# EAGLE design Lego PowerFunctions I2C RPi Connect (EAGLE 7.2.0)
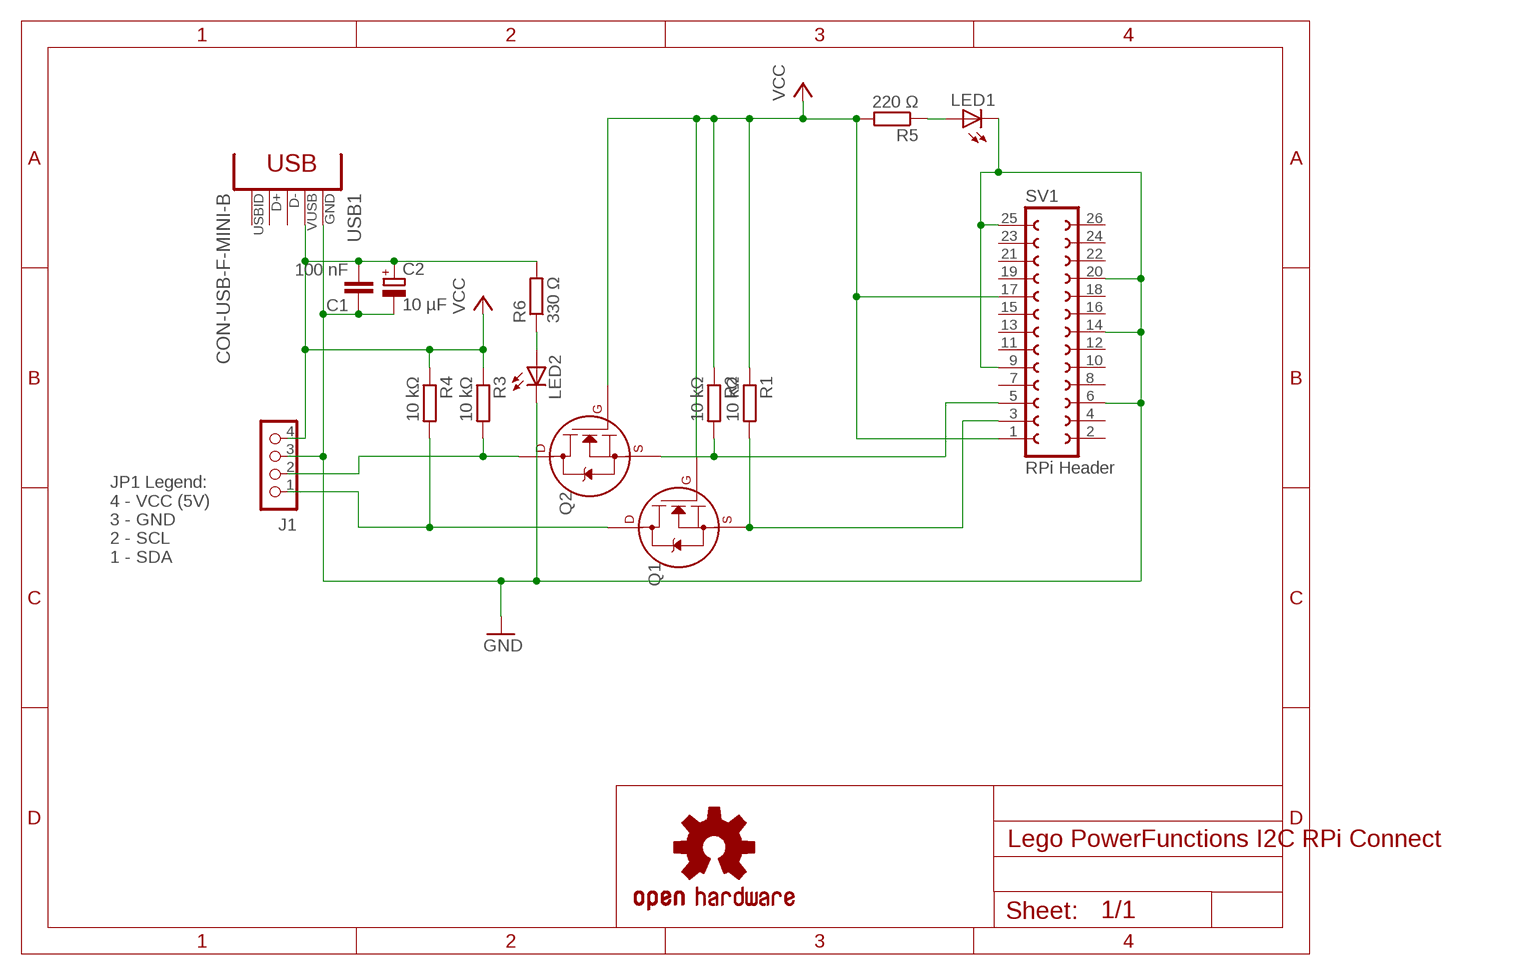
[diagram p0: schematic, sheet 1]

## Parts
C1  100 nF  C-EU025-025X050  [C025-025X050]
C2  10 µF  CPOL-EUE2.5-6  [E2,5-6]
J1  CON_HEADER_1X04  [M1X4]
LED1  LED3MM  [LED3MM]
LED2  LED3MM  [LED3MM]
LOGO1  OSHW-LOGOL  [OSHW-LOGO-L]
Q1  2N7000_TO92  [TO-92]
Q2  2N7000_TO92  [TO-92]
R1  10 kΩ  R-EU_0207/10  [0207/10]
R2  10 kΩ  R-EU_0207/10  [0207/10]
R3  10 kΩ  R-EU_0207/10  [0207/10]
R4  10 kΩ  R-EU_0207/10  [0207/10]
R5  220 Ω  R-EU_0207/10  [0207/10]
R6  330 Ω  R-EU_0207/10  [0207/10]
SV1  RPi Header  FE13-2  [FE13-2]
USB1  CON-USB-F-MINI-B  [CONN_USB_MINI-B]

## Nets
GND: C1.1 C2.- J1.3 LED1.K(C) LED2.K(C) SV1.6 SV1.9 SV1.14 SV1.20 SV1.25 USB1.GND
N$1: LED1.A R5.1
N$2: LED2.A R6.1
N$3: Q1.1(S) R1.2 SV1.3
SCL_HV: J1.2 Q2.3(D) R3.2
SCL_LV: Q2.1(S) R2.2 SV1.5
SDA_HV: J1.1 Q1.3(D) R4.2
VCC_HV: C1.2 C2.+ J1.4 R3.1 R4.1 R6.2 USB1.VUSB ; supply symbol labelled VCC
VCC_LV: Q1.2(G) Q2.2(G) R1.1 R2.1 R5.2 SV1.1 SV1.17 ; supply symbol labelled VCC
Unconnected: SV1.2 SV1.4 SV1.7 SV1.8 SV1.10 SV1.11 SV1.12 SV1.13 SV1.15 SV1.16 SV1.18 SV1.19 SV1.21 SV1.22 SV1.23 SV1.24 SV1.26 USB1.BODY@1(BODY) USB1.BODY@2(BODY) USB1.BODY@3(BODY) USB1.BODY@4(BODY) USB1.D+ USB1.D- USB1.ID(USBID)

## Notes on the sheet
- JP1 Legend:
  4 - VCC (5V)
  3 - GND
  2 - SCL
  1 - SDA

## Library data of the parts
C1 = rcl:C-EU: CAPACITOR, European symbol
C2 = rcl:CPOL-EU: POLARIZED CAPACITOR, European symbol
J1 = dp_devices:CON_HEADER_1X04
LED1 LED2 = led:LED: LED OSRAM: - CHIPLED LG R971, LG N971, LY N971, LG Q971, LY Q971, LO R971, LY R971 LH N974, LH R974 LS Q976, LO Q976, LY Q976 LO Q996 - Hyper CHIPLED LW Q18S LB Q993, LB Q99A, LB R99A - SideLED LS A670, LO A670, LY A670, LG A670, LP A670 LB A673, LV A673, LT A673, LW A673 LH A674 LY A675 LS A676, LA A676, LO A676, LY A676, LW A676 LS A679, LY A679, LG A679 - Hyper Micro SIDELED® LS Y876, LA Y876, LO Y876, LY Y876 LT Y87S - SmartLED LW L88C, LW L88S LB L89C, LB L89S, LG L890 LS L89K, LO L89K, LY L89K LS L896, LA L896, LO L896, LY L896 - TOPLED LS T670, LO T670, LY T670, LG T670, LP T670 LSG T670, LSP T670, LSY T670, LOP T670, LYG T670 LG T671, LOG T671, LSG T671 LB T673, LV T673, LT T673, LW T673 LH T674 LS T676, LA T676, LO T676, LY T676, LB T676, LH T676, LSB T676, LW T676 LB T67C, LV T67C, LT T67C, LS T67K, LO T67K, LY T67K, LW E67C LS E67B, LA E67B, LO E67B, LY E67B, LB E67C, LV E67C, LT E67C LW T67C LS T679, LY T679, LG T679 LS T770, LO T770, LY T770, LG T770, LP T770 LB T773, LV T773, LT T773, LW T773 LH T774 LS E675, LA E675, LY E675, LS T675 LS T776, LA T776, LO T776, LY T776, LB T776 LHGB T686 LT T68C, LB T68C - Hyper Mini TOPLED® LB M676 - Mini TOPLED Santana® LG M470 LS M47K, LO M47K, LY M47K Source: http://www.osram.convergy.de LUXEON: - LUMILED® LXK2-PW12-R00, LXK2-PW12-S00, LXK2-PW14-U00, LXK2-PW14-V00 LXK2-PM12-R00, LXK2-PM12-S00, LXK2-PM14-U00 LXK2-PE12-Q00, LXK2-PE12-R00, LXK2-PE12-S00, LXK2-PE14-T00, LXK2-PE14-U00 LXK2-PB12-K00, LXK2-PB12-L00, LXK2-PB12-M00, LXK2-PB14-N00, LXK2-PB14-P00, LXK2-PB14-Q00 LXK2-PR12-L00, LXK2-PR12-M00, LXK2-PR14-Q00, LXK2-PR14-R00 LXK2-PD12-Q00, LXK2-PD12-R00, LXK2-PD12-S00 LXK2-PH12-R00, LXK2-PH12-S00 LXK2-PL12-P00, LXK2-PL12-Q00, LXK2-PL12-R00 Source: www.luxeon.com KINGBRIGHT: KA-3528ASYC Source: www.kingbright.com
LOGO1 = SparkFun-Aesthetics:OSHW-LOGO: Open Source Hardware Logo This logo indicates the piece of hardware it is found on incorporates a OSHW license and/or adheres to the definition of open source hardware found here: http://freedomdefined.org/OSHW
Q1 Q2 = transistors:2N700*: 2N7000, 2N7002, NDS7002A N-channel enhancement mode MOSFET
R1-R6 = rcl:R-EU_: RESISTOR, European symbol
SV1 = con-lsta:FE13-2: FEMALE HEADER; OC_FARNELL: unknown; OC_NEWARK: unknown
USB1 = dp_devices:CON-USB-F: USB Female connector

## Board
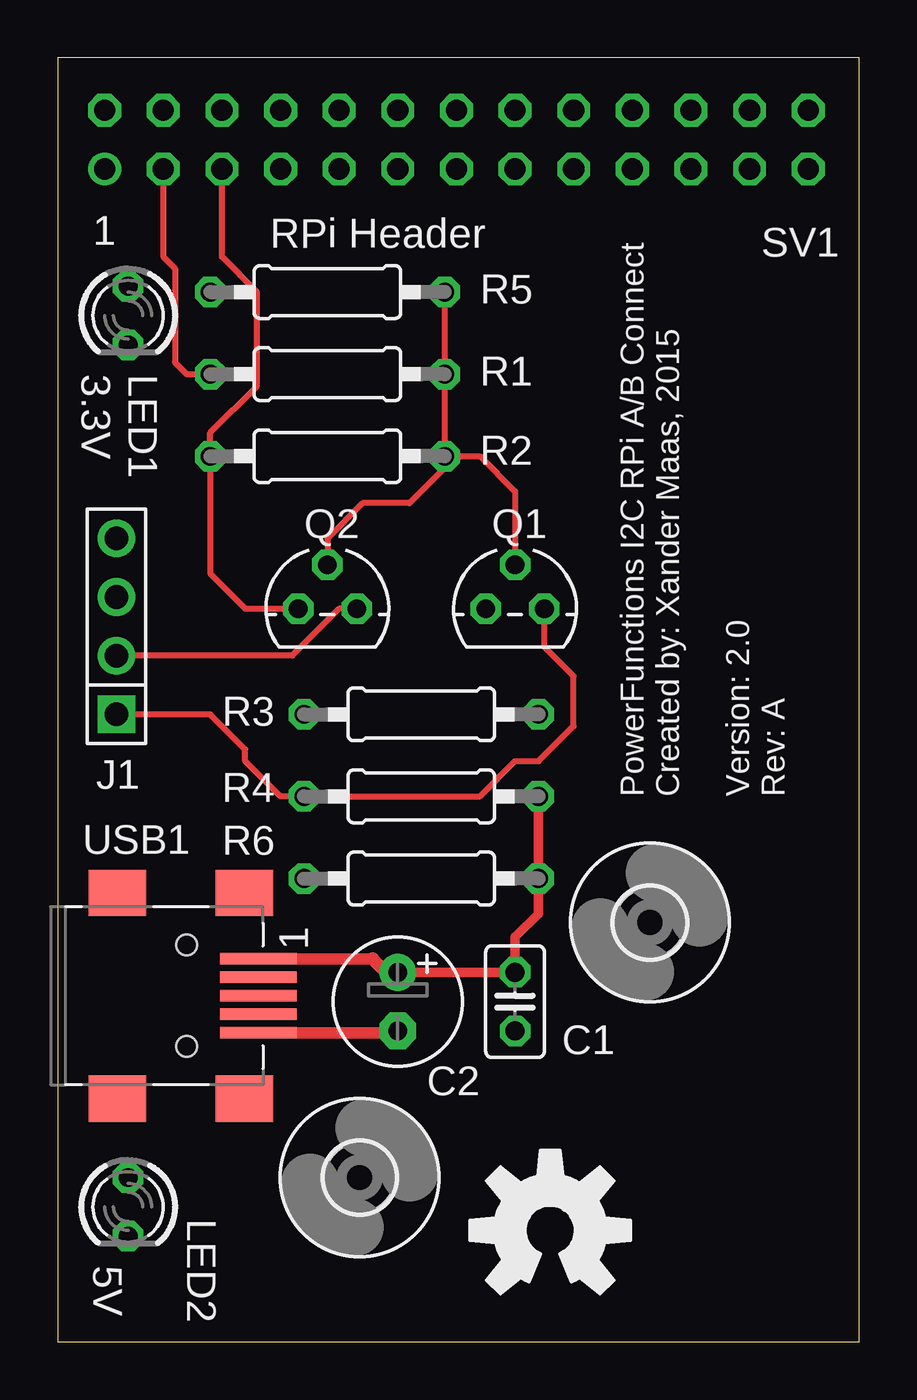
[diagram p1: board, top side]
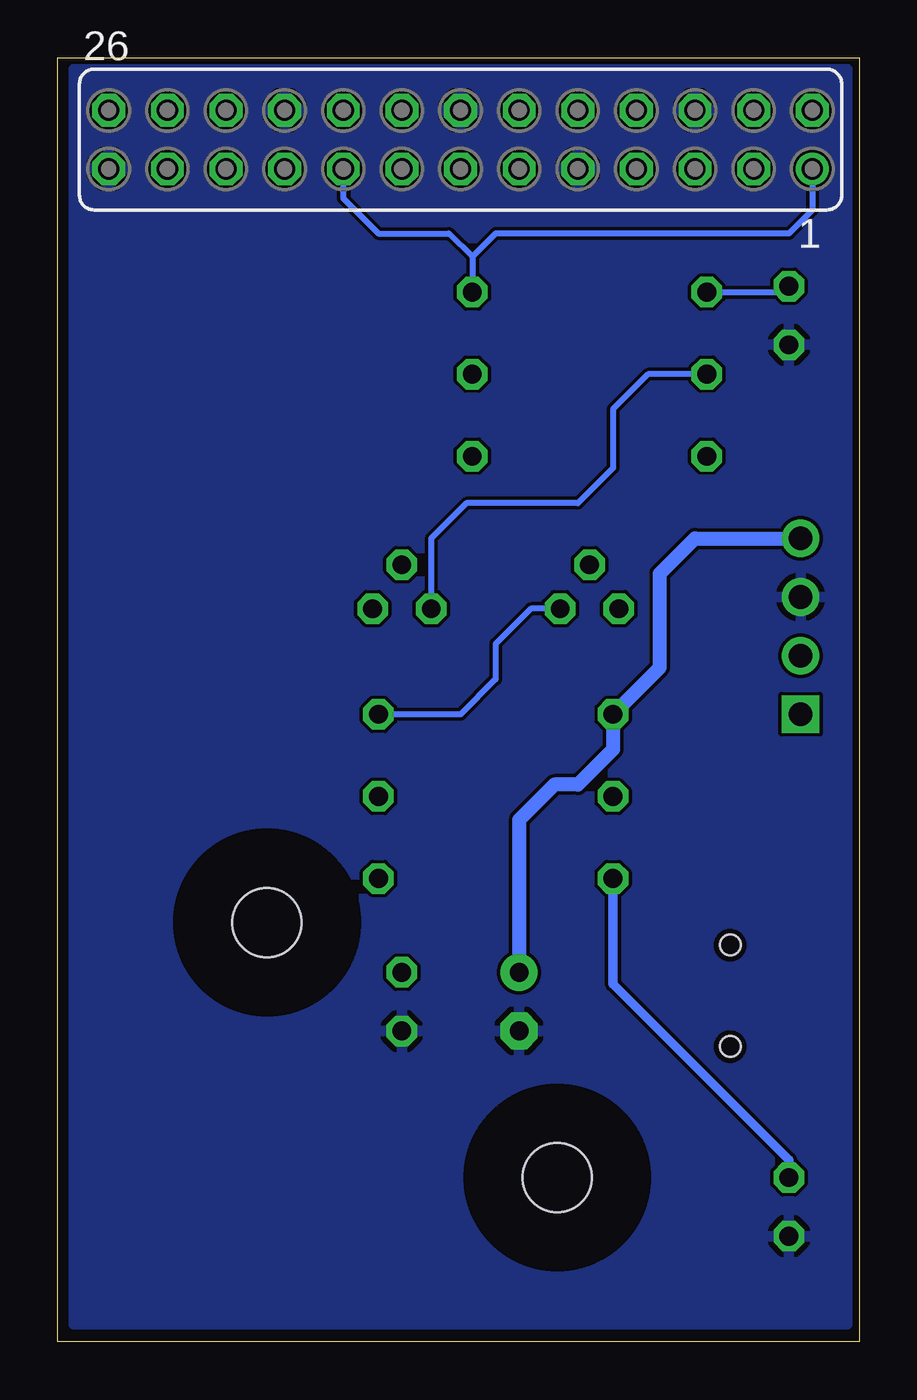
[diagram p2: board, bottom side, seen from below]

Size 34.72 x 55.62 mm. Coordinates in mm from the lower left corner, seen from the top.
Outline: 0,0 34.72,0 34.72,55.62 0,55.62 0,0
Copper layers (1*16): Top 0.035mm / dielectric 1.5mm / Bottom 0.035mm
Design rules "SeeedStudio_2layer_DRU_no_angle_20140221": minimum track width 6mil, minimum drill 12mil, track to track 6mil, track to pad 6mil, pad to pad 6mil, via to via 6mil, smd to smd 0mil, copper to edge 10mil, drill to drill 10mil, minimum pad ring 10mil, minimum via ring 6mil, stop-mask expansion 2mil, vias tented up to drill 100mil, thermal gap 10mil

### Footprints (pad centres in the part's own frame; a part is rotated, then mirrored left to right if it is on the bottom)
C025-025X050 = drill 0.813 octagon: 1 -1.27,0; 2 1.27,0
E2,5-6 = drill 0.813 pad 1.6: + -1.27,0 | drill 0.813 pad 1.6 octagon: - 1.27,0
M1X4 = drill 1.02 pad 1.632 square: 1 0,0 | drill 1.02 pad 1.632: 2 2.54,0; 3 5.08,0; 4 7.62,0
LED3MM = drill 0.813 octagon: A -1.27,0; K 1.27,0
TO-92 = drill 0.813 octagon: 1 -1.27,0; 2 0,1.905; 3 1.27,0
0207/10 = drill 0.813 octagon: 1 -5.08,0; 2 5.08,0
FE13-2 = drill 0.914: 1 -15.24,1.27 | drill 0.914 octagon: 2 -15.24,-1.27; 3 -12.7,1.27; 4 -12.7,-1.27; 5 -10.16,1.27; 6 -10.16,-1.27; 7 -7.62,1.27; 8 -7.62,-1.27; 9 -5.08,1.27; 10 -5.08,-1.27; 11 -2.54,1.27; 12 -2.54,-1.27; 13 0,1.27; 14 0,-1.27; 15 2.54,1.27; 16 2.54,-1.27; 17 5.08,1.27; 18 5.08,-1.27; 19 7.62,1.27; 20 7.62,-1.27; 21 10.16,1.27; 22 10.16,-1.27; 23 12.7,1.27; 24 12.7,-1.27; 25 15.24,1.27; 26 15.24,-1.27
3,0 = hole 3: 0,0
CONN_USB_MINI-B = smd 2 x 2.5: BODY@1 -4.45,2.5; BODY@2 4.45,2.5; BODY@3 4.45,-3; BODY@4 -4.45,-3 | smd 0.5 x 3.3: D+ 0,3.1; D- -0.8,3.1; GND 1.6,3.1; ID 0.8,3.1; VUSB -1.6,3.1 | hole 0.9: -2.2,0; 2.2,0

### Placement (x,y rotation side)
C1  19.81,14.73 90 top
C2  14.73,14.73 270 top
J1  2.54,27.18 90 top
LED1  3.05,44.45 270 top
LED2  3.05,5.84 270 top
LOGO1  21.34,4.83 0 top
Q1  19.81,31.75 0 top
Q2  11.68,31.75 0 top
R1  11.68,41.91 180 top
R2  11.68,38.35 180 top
R3  15.75,27.18 0 top
R4  15.75,23.62 180 top
R5  11.68,45.47 0 top
R6  15.75,20.07 0 top
SV1  17.27,52.07 180 bottom
U$1  [3,0]  13.08,7.11 0 top
U$3  [3,0]  25.65,18.16 0 top
USB1  5.59,14.99 270 top

### Tracks (layer width: path | path; a pad name or v marks a point on that pad's centre or on a via)
GND
  Top 0.406: 14.66,13.39 C2.-
  Top 0.508: USB1.GND 14.66,13.39
  pour Bottom: 0.51,55.12 0.51,0.76 34.04,0.76 34.04,55.12
N$1
  Bottom 0.254: R5.1 3.3,45.47 LED1.A
N$2
  Bottom 0.406: R6.1 10.67,15.49 3.05,7.87 LED2.A
N$3
  Top 0.254: SV1.3 4.57,46.99 5.08,46.48 5.08,42.42 5.59,41.91 R1.2
  Bottom 0.254: R1.2 9.14,41.91 10.67,40.39 10.67,37.85 12.19,36.32 17.02,36.32 18.54,34.8 Q1.1
SCL_HV
  Top 0.254: Q2.3 12.19,31.75 10.16,29.72 J1.2
  Bottom 0.254: Q2.3 14.22,31.75 15.75,30.23 15.75,28.7 17.27,27.18 R3.2
SCL_LV
  Top 0.254: SV1.5 7.11,46.99 8.64,45.47 8.64,41.4 6.6,39.37 R2.2 6.6,33.27 8.13,31.75 Q2.1
SDA_HV
  Top 0.254: J1.1 6.6,27.18 8.13,25.65 8.13,25.15 9.65,23.62 R4.2 18.29,23.62 19.81,25.15 20.83,25.15 22.35,26.67 22.35,28.83 21.08,30.1 Q1.3
VCC_HV
  Top 0.406: 14.22,16 C2.+ C1.2 19.81,17.53 20.83,18.54 R6.2 R4.1
  Top 0.508: USB1.VUSB 13.64,16.59
  Top 0.559: 13.64,16.59 14.22,16
  Bottom 0.61: C2.+ 14.73,22.61 13.21,24.13 12.19,24.13 10.67,25.65 R3.1 8.64,29.21 8.64,33.27 7.11,34.8 J1.4
VCC_LV
  Top 0.254: R5.2 R1.1 R2.1 | R2.1 16.76,37.85 15.24,36.32 13.21,36.32 11.68,34.8 Q2.2 | R2.1 18.29,38.35 19.81,36.83 Q1.2
  Bottom 0.254: SV1.1 2.03,49.02 3.05,48.01 15.75,48.01 16.76,46.99 | 16.76,46.99 R5.2 | SV1.17 22.35,49.53 20.83,48.01 17.78,48.01 16.76,46.99

### Text on the board
tNames: 1 | 3.3V | PowerFunctions I2C RPi A/B Connect / Created by: Xander Maas, 2015 | Version: 2.0 / Rev: A | 5V